# EAGLE schematic fc power board (EAGLE 7.4.0)
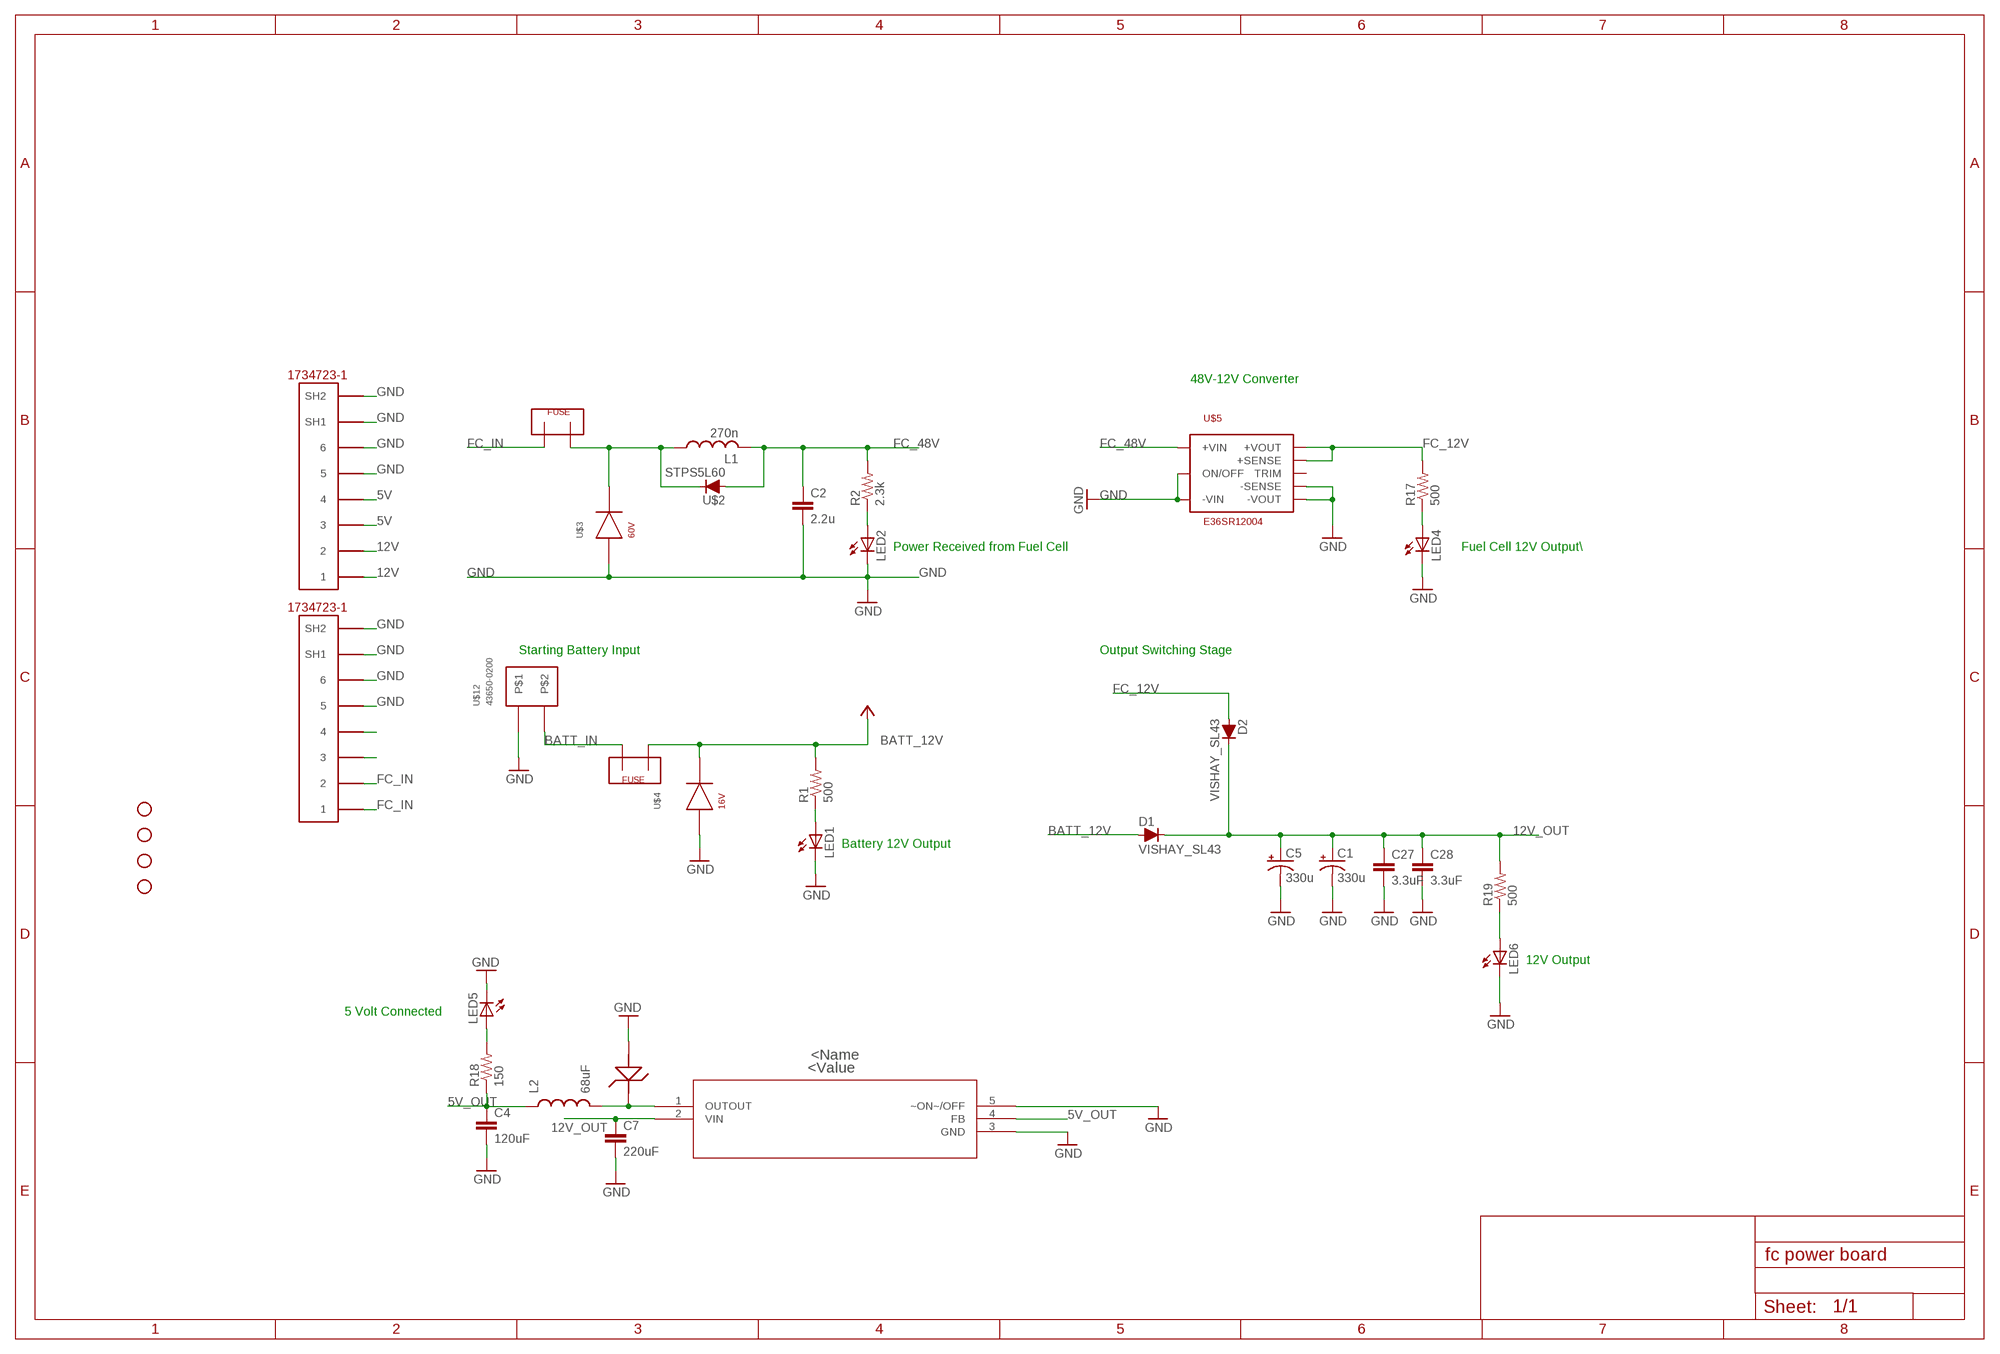
[diagram p0: schematic, sheet 1]

## Parts
C1  330u  CAP_POLE  [PANASONIC_E]
C2  2.2u  C-EUC1210  [C1210]
C4  120uF  CAP0805  [0805]
C5  330u  CAP_POLE  [PANASONIC_E]
C7  220uF  CAP0805  [0805]
C27  3.3uF  C-EUC0805K  [C0805K]
C28  3.3uF  C-EUC0805K  [C0805K]
D1  VISHAY_SL43  [DO-214AB_SMC]
D2  VISHAY_SL43  [DO-214AB_SMC]
L1  270n  L-USL3225P  [L3225P]
L2  68uF  INDUCTOR0805  [0805]
LED1  LED1206  [LED-1206]
LED2  LED1206  [LED-1206]
LED4  LED1206  [LED-1206]
LED5  LED1206  [LED-1206]
LED6  LED1206  [LED-1206]
R1  500  R-US_M0805  [M0805]
R2  2.3k  R-US_M0805  [M0805]
R17  500  R-US_M0805  [M0805]
R18  150  R-US_M0805  [M0805]
R19  500  R-US_M0805  [M0805]
STANDOFF1  STAND-OFF  [STAND-OFF]
STANDOFF2  STAND-OFF  [STAND-OFF]
STANDOFF3  STAND-OFF  [STAND-OFF]
STANDOFF4  STAND-OFF  [STAND-OFF]
U$2  STPS5L60  [STM_SMC]
U$3  SMBJ60CA  [.277X.089]
U$4  SMAJ16CA  [.25X.07]
U$5  E36SR12004  [2.30X0.90X0.34]
U$6  5555140-6  [1734723-1_RJ11]
U$7  FUSEMINI-BLADE  [MINI-BLADE-FUSE]
U$8  LM2595T-5.0  [T05D]
U$9  MURS120T3G  [MURS120T3G]
U$10  FUSEMINI-BLADE  [MINI-BLADE-FUSE]
U$11  5555140-6  [1734723-1_RJ11]
U$12  43650-0200  [43650-0200]

## Nets
5V: U$11.3 U$11.4
5V_OUT: C4.1 L2.1 R18.1 U$8.4(FB)
12V: U$11.1 U$11.2
12V_OUT: C1.+ C5.+ C7.1 C27.1 C28.1 D1.C D2.C R19.2 U$8.2(VIN)
BATT_12V: D1.A R1.2 U$4.CATHODE U$10.OUT ; supply symbol labelled +5V
BATT_IN: U$10.IN U$12.P$1
FC_12V: D2.A R17.2 U$5.P$7(+SENSE) U$5.P$8(+VOUT)
FC_48V: C2.1 L1.2 R2.2 U$2.A U$5.P$1(+VIN)
FC_FUSED: L1.1 U$2.C U$3.CATHODE U$7.IN
FC_IN: U$6.1 U$6.2 U$7.OUT
GND: C1.- C2.2 C4.2 C5.- C7.2 C27.2 C28.2 LED1.C LED2.C LED4.C LED5.C LED6.C U$3.ANODE U$4.ANODE U$5.P$2(ON/OFF) U$5.P$3(-VIN) U$5.P$4(-VOUT) U$5.P$5(-SENSE) U$6.5 U$6.6 U$6.SH1 U$6.SH2 U$8.3(GND) U$8.5(~ON~/OFF) U$9.P$2(PIN1) U$11.5 U$11.6 U$11.SH1 U$11.SH2 U$12.P$2
N$3: LED1.A R1.1
N$4: LED2.A R2.1
N$16: L2.2 U$8.1(OUTOUT) U$9.P$1
N$17: LED5.A R18.2
N$20: U$6.4
N$21: LED4.A R17.1
N$23: U$6.3
N$24: LED6.A R19.1
Unconnected: U$5.P$6(TRIM)

## Notes on the sheet
- 48V-12V Converter
- Power Received from Fuel Cell | Fuel Cell 12V Output\
- Starting Battery Input | Output Switching Stage
- Battery 12V Output
- 12V Output
- 5 Volt Connected

## Library data of the parts
C1 C5 = SparkFun-Capacitors:CAP_POL: Capacitor Polarized These are standard SMD and PTH capacitors. Normally 10uF, 47uF, and 100uF in electrolytic and tantalum varieties. Always verify the external diameter of the through hole cap, it varies with capacity, voltage, and manufacturer. The EIA devices should be standard.
C2 C27 C28 = resistor:C-EU: CAPACITOR, European symbol
C4 C7 = SparkFun-Passives:CAP: Capacitor Standard 0603 ceramic capacitor, and 0.1" leaded capacitor.
D1 D2 = Power Board Components:VISHAY_SL43
L1 = resistor:L-US: INDUCTOR, American symbol
L2 = SparkFun-Passives:INDUCTOR: Inductors Basic Inductor/Choke - 0603 and 1206. Footprints are not proven and vary greatly between part numbers. INDUCTOR POWER 3.3UH 4.0A SMD 0.197" L x 0.197" W x 0.177" H (5.00mm x 5.00mm x 4.50mm)
LED1 LED2 LED4-LED6 = SparkFun:LED: LEDs Standard schematic elements and footprints for 5mm, 3mm, 1206, and 0603 sized LEDs. 5mm - Spark Fun Electronics SKU : COM-00529 (and others)
R1 R2 R17-R19 = rcl:R-US_: RESISTOR, American symbol
STANDOFF1-STANDOFF4 = SparkFun-Electromechanical:STAND-OFF: #4 Stand Off This is the mechanical footprint for a #4 phillips button head screw. Use the keepout ring to avoid running the screw head into surrounding components. SKU : PRT-00447
U$2 = Power Board Components:STPS5L60
U$3 = Power Board Components:SMBJ60CA
U$4 = Power Board Components:SMAJ16CA
U$5 = Power Board Components:E36SR12004
U$6 U$11 = 5555140-6 RJ11:5555140-6
U$7 U$10 = Shell2013:FUSE
U$8 = 5V Reg LM2595T-5.0:LM2595T-5.0; BASE_PN: LM259X; COMPTYPE: Switcher; COPYRIGHT: Copyright C 2015 Accelerated Designs. All rights reserved; MANUFACTURER_PART_NUMBER: LM2595T50; SYMBOL: NameLM2595T50; TYPE: LM2595T5.0; VENDOR: National Semiconductor; VERSION: 05022007
U$9 = MURS120T3G:MURS120T3G
U$12 = Shell2013:43650-0200